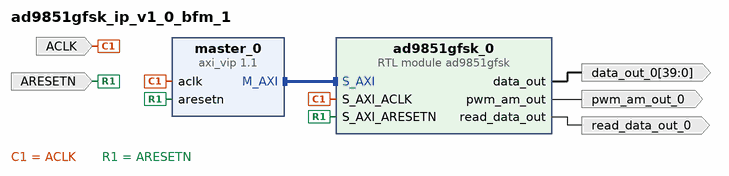
[diagram p0: block diagram of the top level]
# Vivado block design ad9851gfsk_ip_v1_0_bfm_1, xc7z010clg400-1, Vivado 2022.2
create_bd_design ad9851gfsk_ip_v1_0_bfm_1

create_bd_port -dir I -type clk ACLK
set_property -dict [list \
  CONFIG.ASSOCIATED_RESET ARESETN \
  CONFIG.CLK_DOMAIN ad9851gfsk_ip_v1_0_bfm_1_ACLK \
  CONFIG.FREQ_HZ 100000000 \
  CONFIG.PHASE 0.000 \
] [get_bd_ports ACLK]
create_bd_port -dir I -type rst ARESETN
set_property -dict {CONFIG.POLARITY ACTIVE_LOW} [get_bd_ports ARESETN]
create_bd_port -dir O read_data_out_0
create_bd_port -dir O -from 39 -to 0 data_out_0
create_bd_port -dir O pwm_am_out_0

create_bd_cell -type ip -vlnv xilinx.com:ip:axi_vip:1.1 master_0
set_property -dict [list \
  CONFIG.ADDR_WIDTH 32 \
  CONFIG.DATA_WIDTH 32 \
  CONFIG.HAS_BRESP 1 \
  CONFIG.HAS_PROT 1 \
  CONFIG.HAS_RRESP 1 \
  CONFIG.HAS_WSTRB 1 \
  CONFIG.INTERFACE_MODE MASTER \
  CONFIG.PROTOCOL AXI4LITE \
  CONFIG.READ_WRITE_MODE READ_WRITE \
] [get_bd_cells master_0]
create_bd_cell -type module -reference ad9851gfsk ad9851gfsk_0
set_property -dict {CONFIG.demo_mode 0} [get_bd_cells ad9851gfsk_0]

# ---- connections ----

connect_bd_intf_net [get_bd_intf_pins master_0/M_AXI] [get_bd_intf_pins ad9851gfsk_0/S_AXI]
connect_bd_net -net aclk_net [get_bd_ports ACLK] [get_bd_pins master_0/aclk] [get_bd_pins ad9851gfsk_0/S_AXI_ACLK]
connect_bd_net [get_bd_pins ad9851gfsk_0/data_out] [get_bd_ports data_out_0]
connect_bd_net [get_bd_pins ad9851gfsk_0/pwm_am_out] [get_bd_ports pwm_am_out_0]
connect_bd_net [get_bd_pins ad9851gfsk_0/read_data_out] [get_bd_ports read_data_out_0]
connect_bd_net -net aresetn_net [get_bd_ports ARESETN] [get_bd_pins master_0/aresetn] [get_bd_pins ad9851gfsk_0/S_AXI_ARESETN]

validate_bd_design
save_bd_design
